# EAGLE board BMS_Master (EAGLE 6.6.0)
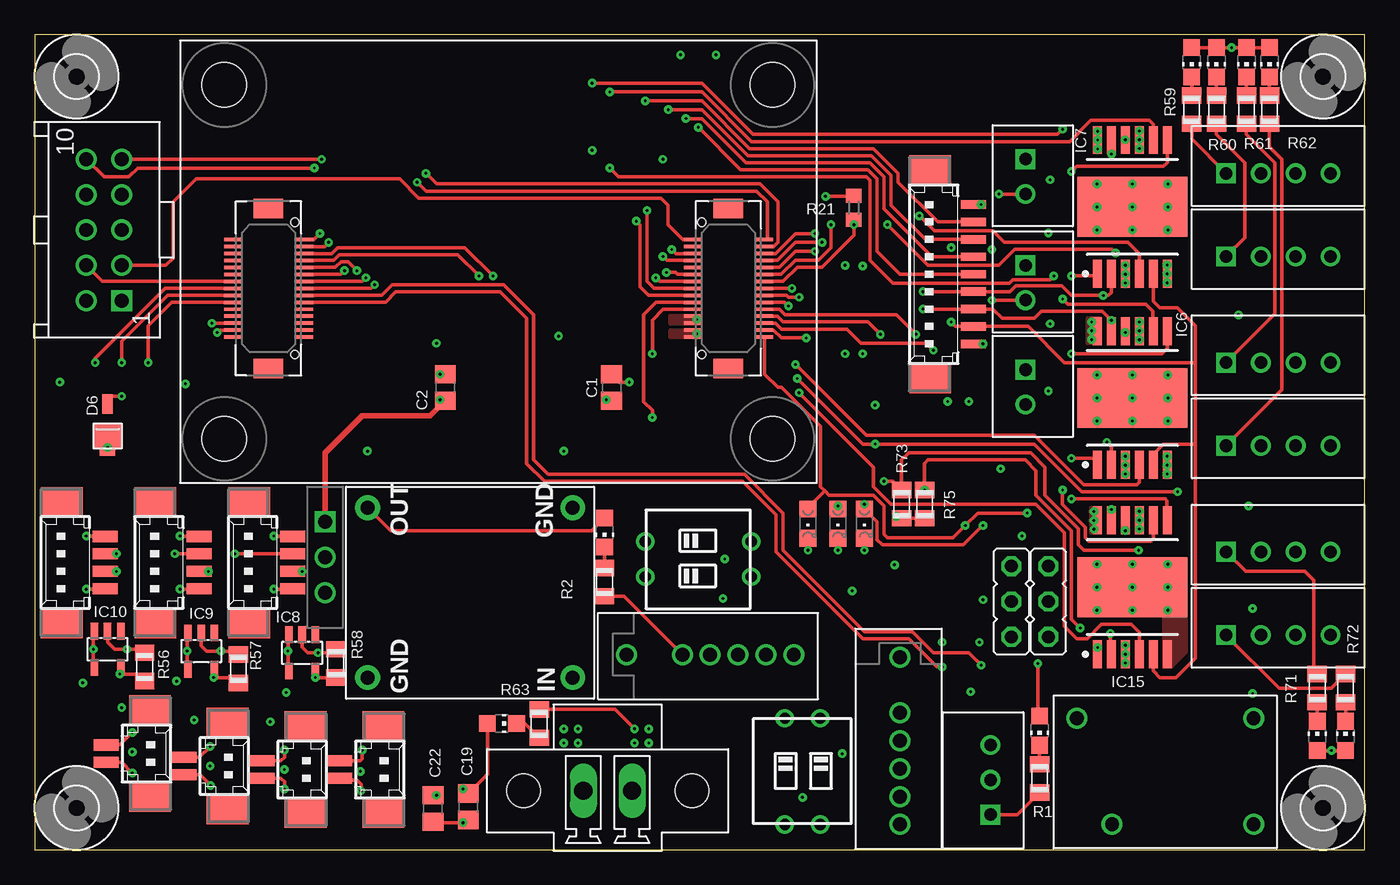
[diagram p6: board, top side]
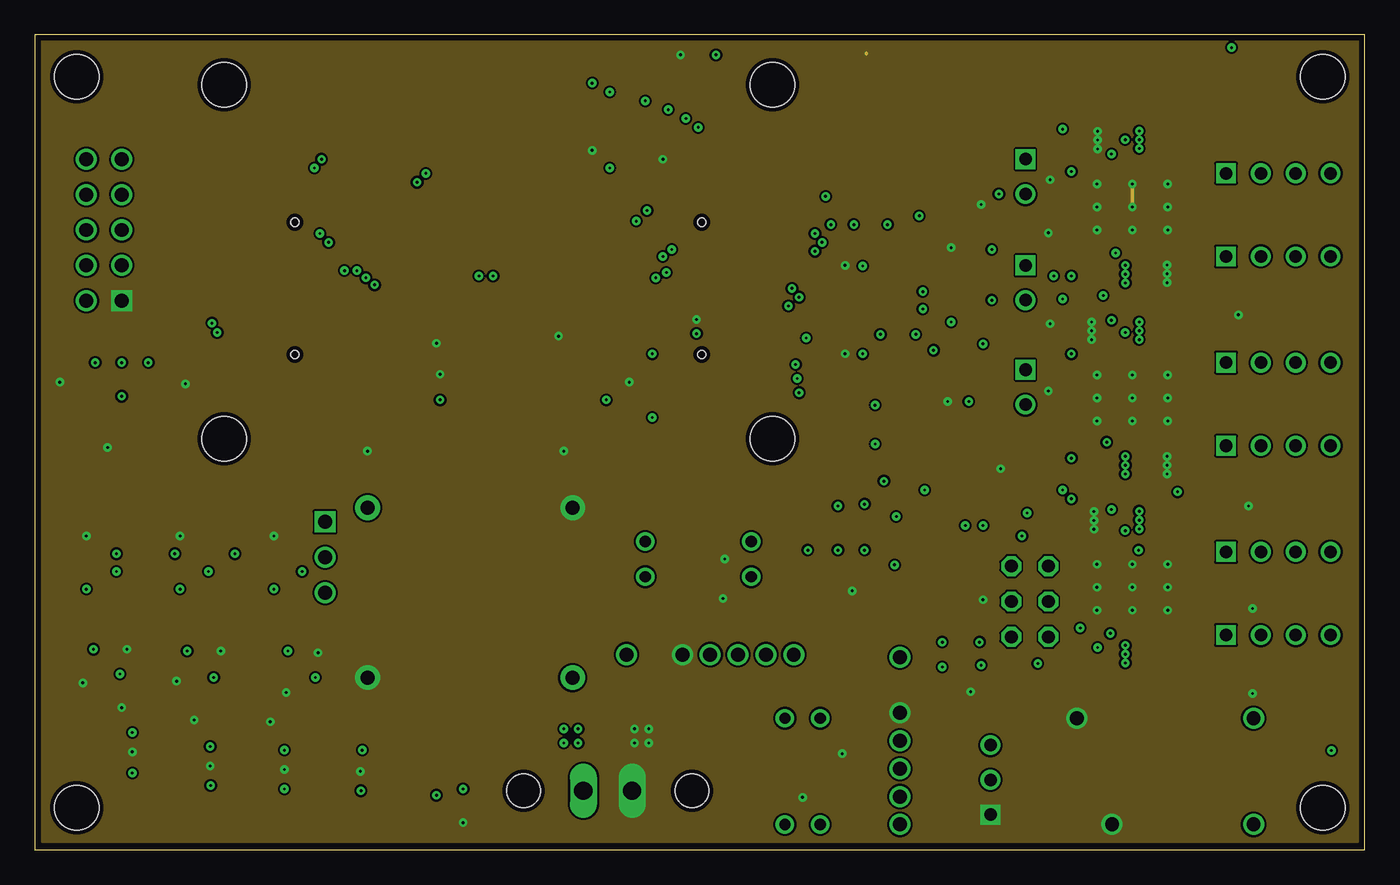
[diagram p7: board, inner layer Route2]
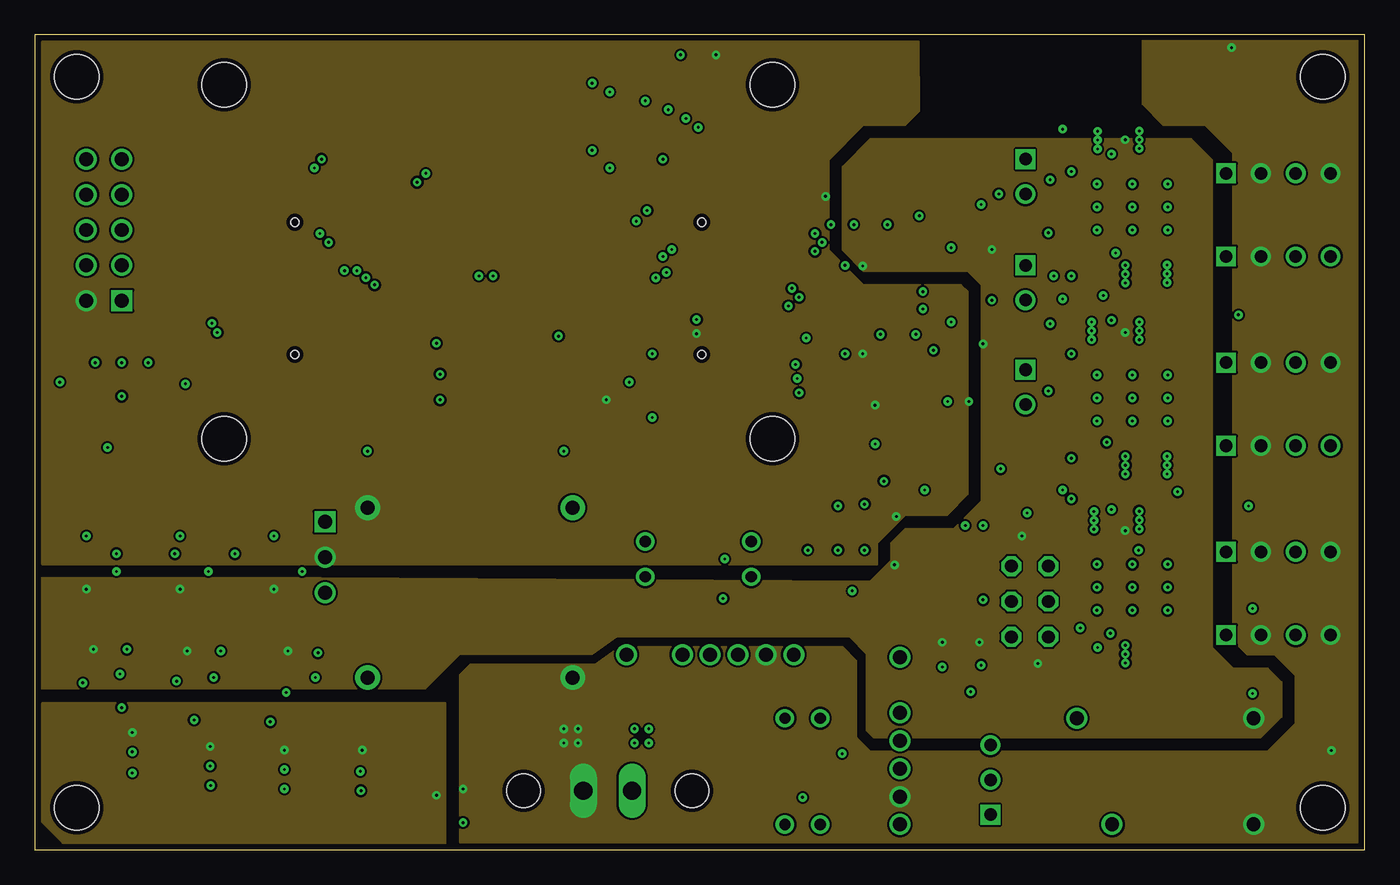
[diagram p8: board, inner layer Route15]
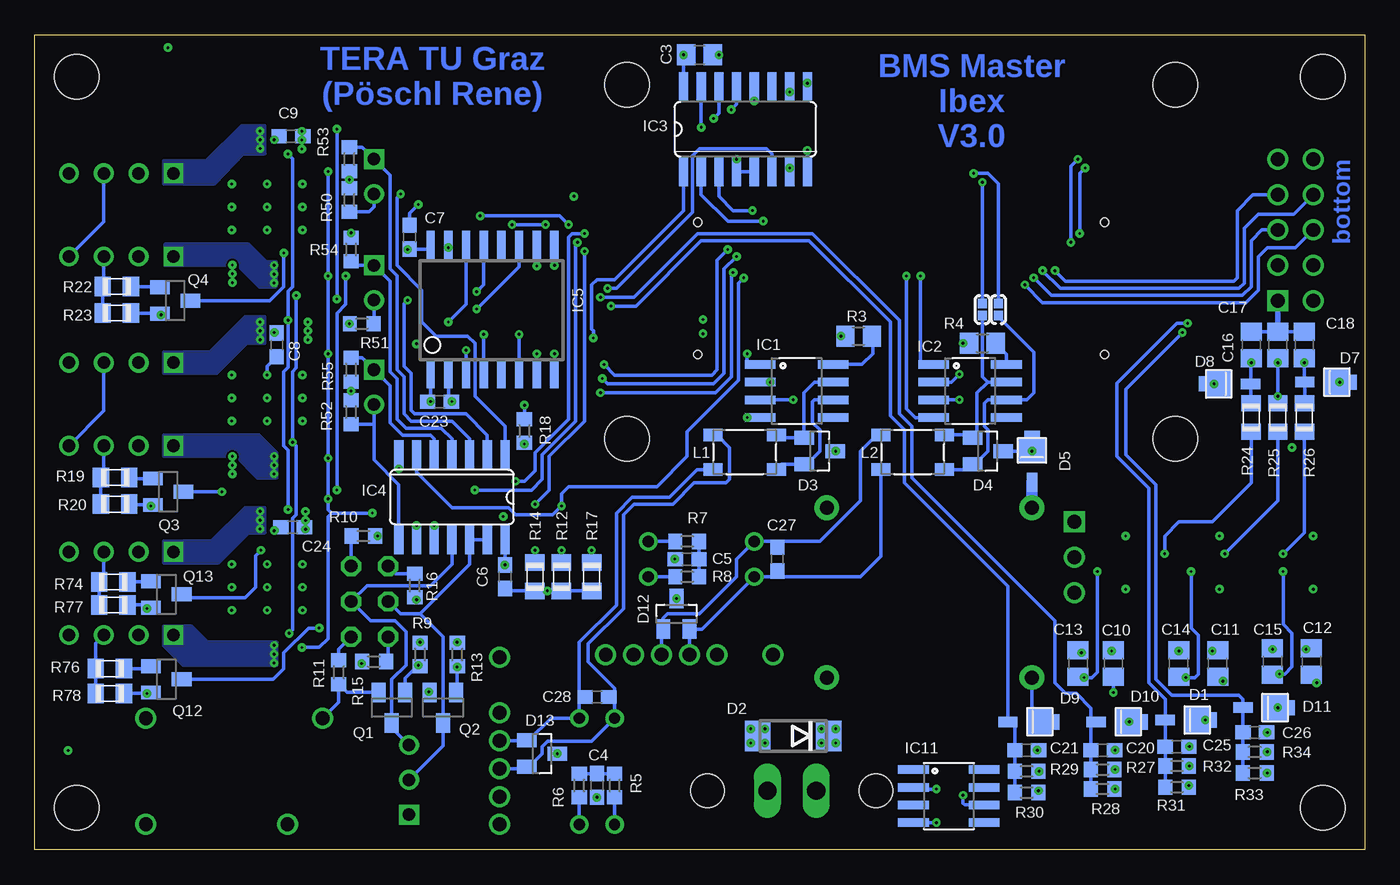
[diagram p9: board, bottom side, seen from below]

Size 95.5 x 58.5 mm. Coordinates in mm from the lower left corner, seen from the top.
Outline: 0,0 95.5,0 95.5,58.5 0,58.5 0,0
Copper layers (1+2*15+16): Top 0.035mm / dielectric 0.2mm / Route2 0.035mm / dielectric 0.5mm / Route15 0.035mm / dielectric 0.2mm / Bottom 0.035mm
Design rules "ats_35u_4layer *": minimum track width 6mil, minimum drill 0.2mm, track to track 6mil, track to pad 6mil, pad to pad 6mil, via to via 6mil, smd to smd 6mil, copper to edge 0.3mm, drill to drill 8mil, minimum pad ring 10mil, minimum via ring 0.2mm, stop-mask expansion 4mil, vias tented up to drill 0mil, thermal gap 10mil

## Footprints (pad centres in the part's own frame; a part is rotated, then mirrored left to right if it is on the bottom)
C0805 = smd 1.3 x 1.5: 1 -0.95,0; 2 0.95,0
C0603 = smd 1.1 x 1: 1 -0.85,0; 2 0.85,0
53398-09-S = smd 0.6 x 1.8: 1 5,-2.5; 2 3.75,-2.5; 3 2.5,-2.5; 4 1.25,-2.5; 5 0,-2.5; 6 -1.25,-2.5; 7 -2.5,-2.5; 8 -3.75,-2.5; 9 -5,-2.5 | smd 2.1 x 3: S1 7.5,0.625; S2 -7.5,0.625
53398-02 = smd 0.8 x 1.8: 1 0.625,-2.5; 2 -0.625,-2.5 | smd 2.1 x 3: S1 3.125,0.625; S2 -3.125,0.625
SM2T3V3A = smd 1.82 x 2.03: P$1 -1.21,0 | smd 1.38 x 0.75: P$2 1.1,0 | smd 0.5 x 1.1: P$11 -2.37,0.005
DO214AA = smd 1.8 x 2.2: A 2.55,0; C -2.55,0
SOT23 = smd 1 x 1.4: 1 -0.95,-1.1; 2 0.95,-1.1; 3 0,1.1
3,2 = hole 3.2: 0,0
SO08 = smd 0.61 x 2.21: 1 -1.905,-2.616; 2 -0.635,-2.616; 3 0.635,-2.616; 4 1.905,-2.616; 5 1.905,2.616; 6 0.635,2.616; 7 -0.635,2.616; 8 -1.905,2.616
SO16 = smd 0.66 x 2.032: 1 -4.445,-3.073; 2 -3.175,-3.073; 3 -1.905,-3.073; 4 -0.635,-3.073; 5 0.635,-3.073; 6 1.905,-3.073; 7 3.175,-3.073; 8 4.445,-3.073; 9 4.445,3.073; 10 3.175,3.073; 11 1.905,3.073; 12 0.635,3.073; 13 -0.635,3.073; 14 -1.905,3.073; 15 -3.175,3.073; 16 -4.445,3.073
SO14 = smd 0.66 x 2.032: 1 -3.81,-3.073; 2 -2.54,-3.073; 3 -1.27,-3.073; 4 0,-3.073; 5 1.27,-3.073; 6 2.54,-3.073; 7 3.81,-3.073; 8 3.81,3.073; 9 2.54,3.073; 10 1.27,3.073; 11 0,3.073; 12 -1.27,3.073; 13 -2.54,3.073; 14 -3.81,3.073
R-PDSO-G16 = smd 0.6 x 2: 1 -3.937,-4.649; 2 -2.667,-4.649; 3 -1.397,-4.649; 4 -0.127,-4.649; 5 1.143,-4.649; 6 2.413,-4.649; 7 3.683,-4.649; 8 4.953,-4.649; 9 4.953,4.651; 10 3.683,4.651; 11 2.413,4.651; 12 1.143,4.651; 13 -0.127,4.651; 14 -1.397,4.651; 15 -2.667,4.651; 16 -3.937,4.651
INF-PG-DSO-12-11_N_1PRIMARY = smd 2 x 0.65: 1 -4.8,2.5; 2 -4.8,1.5; 3 -4.8,0.5; 4 -4.8,-0.5; 5 -4.8,-1.5; 6 -4.8,-2.5; 7 4.8,-2.5; 8 4.8,-1.5; 9 4.8,-0.5; 10 4.8,0.5; 11 4.8,1.5; 12 4.8,2.5 | smd 4.3 x 7.9: 13 0,0
SOT23-5L = smd 0.55 x 1.2: 1 -0.95,-1.3; 2 0,-1.3; 3 0.95,-1.3; 4 0.95,1.3; 5 -0.95,1.3
SO08' = smd 0.61 x 2.21: 1 -1.905,-2.54; 2 -0.635,-2.54; 3 0.635,-2.54; 4 1.905,-2.54; 5 1.905,2.54; 6 0.635,2.54; 7 -0.635,2.54; 8 -1.905,2.54
J_OR_S = drill 1: P$1 2.54,0; P$3 5.08,0 | drill 1 square: P$2 0,0
JP2_OCT = drill 0.914 octagon: 1 -2.54,0; 2 0,0; 3 2.54,0
ACT45B = smd 1.35 x 0.9: P$1 -0.675,0.45; P$2 3.875,0.45; P$3 -0.675,2.95; P$4 3.875,2.95
CHIP-LED0805 = smd 1.2 x 1.2: A 0,-1.05; C 0,1.05
CHIPLED_0805 = smd 1.2 x 1.2: A 0,-1.05; C 0,1.05
STM32F4_PROZESSORBOARD = smd 1.2 x 0.25: 1 3.75,10.47; 2 8.95,10.47; 3 3.75,10.97; 4 8.95,10.97; 5 3.75,11.47; 6 8.95,11.47; 7 3.75,11.97; 8 8.95,11.97; 9 3.75,12.47; 10 8.95,12.47; 11 3.75,12.97; 12 8.95,12.97; 13 3.75,13.47; 14 8.95,13.47; 15 3.75,13.97; 16 8.95,13.97; 17 3.75,14.47; 18 8.95,14.47; 19 3.75,14.97; 20 8.95,14.97; 21 3.75,15.47; 22 8.95,15.47; 23 3.75,15.97; 24 8.95,15.97; 25 3.75,16.47; 26 8.95,16.47; 27 3.75,16.97; 28 8.95,16.97; 29 3.75,17.47; 30 8.95,17.47; 31 41.97,17.47; 32 41.97,16.97; 33 41.97,16.47; 34 41.97,15.97; 35 41.97,15.47; 36 41.97,14.97; 37 41.97,14.47; 38 41.97,13.97; 39 41.97,13.47; 40 41.97,12.97; 41 41.97,12.47; 42 41.97,11.97; 43 41.97,10.97; 44 41.97,10.47; 45 36.77,10.47; 46 36.77,10.97; 47 36.77,11.47; 48 36.77,11.97; 49 36.77,12.47; 50 36.77,12.97; 51 36.77,13.47; 52 36.77,13.97; 53 36.77,14.47; 54 36.77,14.97; 55 36.77,15.47; 56 36.77,15.97; 57 36.77,16.47; 58 36.77,16.97; 59 36.77,17.47; 60 41.97,11.47 | smd 2.1 x 1.4: M1 6.35,8.22; M2 6.35,19.72; M3 39.37,8.22; M4 39.37,19.72 | hole 3.2: 3.175,3.175; 3.175,28.575; 42.545,28.575; 42.545,3.175 | hole 0.6: 8.25,9.22; 8.25,18.72; 37.47,18.72; 37.47,9.22
R0805 = smd 1.168 x 1.397: 1 -1.016,0; 2 1.016,0
R0805' = smd 1.3 x 1.5: 1 -0.95,0; 2 0.95,0
R0603 = smd 1 x 1.1: 1 -0.85,0; 2 0.85,0
SJ_2S-NO = smd 0.686 x 0.635: 1 -0.425,0; 2 0.425,0
DIPSWITCH-02 = drill 0.813: 1 -1.27,-3.81; 2 1.27,-3.81; 3 1.27,3.81; 4 -1.27,3.81
MAX16956_STEPDOWN6 = drill 1: GND 14.351,1.651; GND2 11.811,9.271; VIN 1.651,9.271; VOUT 1.651,1.651
MAX5035_STEPDOWN3 = drill 1 pad 1.778: GND@1 1.524,16.256; GND@2 13.716,1.524; VIN 1.524,1.524; VOUT 13.716,16.256
MCV1,5/2-GF-3,5 = drill 1.3 long: 1 0,3.5; 2 0,0 | hole 2.4: 0,7.8; 0,-4.3
90130-1110 = drill 1 square: 1 -5.08,-1.27 | drill 1: 2 -5.08,1.27; 3 -2.54,-1.27; 4 -2.54,1.27; 5 0,-1.27; 6 0,1.27; 7 2.54,-1.27; 8 2.54,1.27; 9 5.08,-1.27; 10 5.08,1.27
CIOC_4-1-FV = drill 1: 1 0,0; 2 2,0; 3 4,0; 4 6,0; 5 -4,0; 6 8,0
B2B-XH = drill 0.9 pad 1.422 square: P$1 0,0 | drill 0.9 pad 1.422: P$2 2.5,0
B4B-XH = drill 0.9 pad 1.422 square: P$1 0,0 | drill 0.9 pad 1.422: P$2 2.5,0; P$3 5,0; P$4 7.5,0
53398-04 = smd 0.8 x 1.8: 1 1.875,-2.5; 2 0.625,-2.5; 3 -0.625,-2.5; 4 -1.875,-2.5 | smd 2.1 x 3: S1 4.375,0.625; S2 -4.375,0.625
B3B-XH = drill 0.9 pad 1.422 square: P$1 0,0 | drill 0.9 pad 1.422: P$2 2.5,0; P$3 5,0

## Placement (x,y rotation side)
C1  100n  [C0805]  41.42,33.19 90 top
C2  100n  [C0805]  29.48,33.19 90 top
C3  100n  [C0805]  47.77,57.06 0 bottom
C4  47n  [C0603]  55.14,4.61 270 bottom
C5  47n  [C0603]  48.66,20.87 180 bottom
C6  100n  [C0603]  61.74,19.6 270 bottom
C7  100n  [C0603]  68.6,43.98 270 bottom
C8  100n  [C0603]  78.12,36.24 270 bottom
C9  100n  [C0603]  77.11,51.22 0 bottom
C10  100n  [C0805]  18.05,13.38 270 bottom
C11  100n  [C0805]  10.56,13.38 270 bottom
C12  100n  [C0805]  3.83,13.5 270 bottom
C13  100n  [C0805]  20.59,13.38 90 bottom
C14  100n  [C0805]  13.35,13.38 90 bottom
C15  100n  [C0805]  6.62,13.5 90 bottom
C16  100n  [C0805]  8.15,36.24 90 bottom
C17  100n  [C0805]  6.24,36.24 90 bottom
C18  100n  [C0805]  4.34,36.24 90 bottom
C19  1uF  [C0805]  31.13,3.09 270 top
C20  ?  [C0603]  18.81,7.15 180 bottom
C21  ?  [C0603]  24.28,7.15 180 bottom
C22  2,2uF  [C0805]  28.59,2.96 270 top
C23  100n  [C0603]  66.44,32.17 180 bottom
C24  100n  [C0603]  76.98,23.16 0 bottom
C25  ?  [C0603]  13.48,7.41 180 bottom
C26  ?  [C0603]  7.89,8.42 180 bottom
C27  100p  [C0603]  42.18,20.87 90 bottom
C28  100p  [C0603]  55.14,10.96 0 bottom
CON1  53398-S-09  [53398-09-S]  64.92,41.32 90 top
CON2  53398-02  [53398-02]  24.4,5.76 270 top
CON3  53398-02  [53398-02]  18.81,5.76 270 top
CON4  53398-02  [53398-02]  13.23,6.01 270 top
CON5  53398-02  [53398-02]  7.64,6.9 270 top
D1  SM2T3V3A  [SM2T3V3A]  13.23,9.31 180 bottom
D2  18V  [DO214AA]  41.04,8.17 180 bottom
D3  NUP2105LT1G|SOT23  [SOT23]  39.13,28.62 270 bottom
D4  NUP2105LT1G|SOT23  [SOT23]  27.07,28.62 270 bottom
D5  SM2T3V3A  [SM2T3V3A]  23.89,27.47 270 bottom
D6  SM2T3V3A  [SM2T3V3A]  5.22,30.9 90 top
D7  SM2T3V3A  [SM2T3V3A]  3.19,33.57 180 bottom
D8  SM2T3V3A  [SM2T3V3A]  9.29,33.44 0 bottom
D9  SM2T3V3A  [SM2T3V3A]  24.53,9.19 180 bottom
D10  SM2T3V3A  [SM2T3V3A]  18.18,9.19 180 bottom
D11  SM2T3V3A  [SM2T3V3A]  7.64,10.2 180 bottom
D12  NUP2105LT1G|SOT23  [SOT23]  49.42,16.93 0 bottom
D13  NUP2105LT1G|SOT23  [SOT23]  59.07,6.9 270 bottom
H1  MOUNT-HOLE3.2  [3,2]  92.5,3 0 top
H2  MOUNT-HOLE3.2  [3,2]  3,3 0 top
H3  MOUNT-HOLE3.2  [3,2]  92.5,55.5 0 top
H4  MOUNT-HOLE3.2  [3,2]  3,55.5 0 top
IC1  SN65HVD230D  [SO08]  40.79,32.93 270 bottom
IC2  SN65HVD230D  [SO08]  28.34,32.93 270 bottom
IC3  74HC138D  [SO16]  44.47,51.73 0 bottom
IC4  4073D  [SO14]  65.55,25.31 180 bottom
IC5  ISO7241  [R-PDSO-G16]  63.14,38.78 0 bottom
IC6  TLE8102SGN  [INF-PG-DSO-12-11_N_1PRIMARY]  78.81,32.43 90 top
IC7  TLE8102SGN  [INF-PG-DSO-12-11_N_1PRIMARY]  78.81,46.15 90 top
IC8  1,8V  [SOT23-5L]  19.2,14.14 180 top
IC9  1,8V  [SOT23-5L]  11.96,14.27 180 top
IC10  1,8V  [SOT23-5L]  5.22,14.39 180 top
IC11  5V  [SO08']  29.86,3.85 270 bottom
IC15  TLE8102SGN  [INF-PG-DSO-12-11_N_1PRIMARY]  78.81,18.84 90 top
J3  JUMPER_SWITCHS  [J_OR_S]  20.85,23.54 270 top
JP3  [JP2_OCT]  70.12,17.82 90 top
JP4  [JP2_OCT]  72.79,17.82 270 top
L1  ACT45B-510-2P-TL003  [ACT45B]  46.12,26.84 0 bottom
L2  ACT45B-510-2P-TL003  [ACT45B]  34.05,26.84 0 bottom
LED1  green  [CHIP-LED0805]  72.15,8.55 180 top
LED2  green  [CHIP-LED0805]  40.91,22.77 180 top
LED3  green  [CHIPLED_0805]  57.68,23.41 180 top
LED4  green  [CHIPLED_0805]  59.58,23.41 180 top
LED5  green  [CHIPLED_0805]  55.52,23.41 180 top
LED6  green  [CHIP-LED0805]  83.08,56.53 180 top
LED7  green  [CHIP-LED0805]  84.85,56.53 180 top
LED8  green  [CHIP-LED0805]  87.01,56.53 180 top
LED9  green  [CHIP-LED0805]  88.66,56.53 180 top
LED10  green  [CHIP-LED0805]  33.55,9.06 270 top
LED12  green  [CHIP-LED0805]  92.09,8.17 0 top
LED13  green  [CHIP-LED0805]  94.12,8.17 0 top
PROZ1  STM32F4_PROZESSORBOARDRPZ  [STM32F4_PROZESSORBOARD]  10.43,26.33 0 top
Q1  BSS205N  [SOT23]  69.87,10.2 180 bottom
Q2  BSS205N  [SOT23]  66.19,10.2 180 bottom
Q3  BSS205N  [SOT23]  85.93,25.7 270 bottom
Q4  BSS205N  [SOT23]  85.42,39.41 270 bottom
Q12  BSS205N  [SOT23]  86.05,12.24 270 bottom
Q13  BSS205N  [SOT23]  86.05,18.33 270 bottom
R1  4k7  [R0805]  72.15,5.12 90 top
R2  2k2  [R0805]  40.91,19.22 90 top
R3  50k  [R0805']  36.34,36.87 0 bottom
R4  50k  [R0805']  27.45,36.36 0 bottom
R5  60R  [R0603]  53.87,4.61 270 bottom
R6  60R  [R0603]  56.41,4.61 270 bottom
R7  60R  [R0603]  48.66,22.14 180 bottom
R8  60R  [R0603]  48.66,19.6 180 bottom
R9  10k  [R0603]  67.84,14.01 270 bottom
R10  1k  [R0603]  71.9,22.52 0 bottom
R11  10k  [R0603]  73.68,12.74 90 bottom
R12  2k2  [R0805]  57.68,19.6 90 bottom
R13  10k  [R0603]  65.17,14.01 270 bottom
R14  2k2  [R0805]  59.58,19.6 90 bottom
R15  1k  [R0603]  71.14,13.5 180 bottom
R16  10k  [R0603]  68.22,18.96 90 bottom
R17  2k2  [R0805]  55.52,19.6 90 bottom
R18  1K  [R0603]  60.34,30.07 90 bottom
R19  1K  [R0805]  89.74,26.71 180 bottom
R20  10K  [R0805]  89.74,24.81 180 bottom
R21  1K  [R0603]  58.81,46.09 90 top
R22  1K  [R0805]  89.61,40.43 180 bottom
R23  10K  [R0805]  89.61,38.53 180 bottom
R24  1K  [R0805]  8.15,31.03 90 bottom
R25  1K  [R0805]  6.24,31.03 90 bottom
R26  1K  [R0805]  4.34,31.03 90 bottom
R27  ?  [R0603]  18.81,5.76 0 bottom
R28  ?  [R0603]  18.81,4.36 180 bottom
R29  ?  [R0603]  24.28,5.63 0 bottom
R30  ?  [R0603]  24.28,4.11 180 bottom
R31  ?  [R0603]  13.48,4.49 180 bottom
R32  ?  [R0603]  13.48,6.01 0 bottom
R33  ?  [R0603]  7.89,5.5 180 bottom
R34  ?  [R0603]  7.89,7.03 0 bottom
R50  10K  [R0603]  72.92,46.65 270 bottom
R51  10K  [R0603]  72.03,37.76 0 bottom
R52  10K  [R0603]  72.79,31.41 270 bottom
R53  10K  [R0603]  72.92,49.57 90 bottom
R54  10K  [R0603]  72.79,43.09 270 bottom
R55  10K  [R0603]  72.79,34.46 90 bottom
R56  330R  [R0805]  7.89,13.12 90 top
R57  330R  [R0805]  14.62,13 90 top
R58  330R  [R0805]  21.61,13.38 90 top
R59  12k  [R0805]  83.08,53.13 90 top
R60  12k  [R0805]  84.85,53.13 90 top
R61  12k  [R0805]  87.01,53.13 90 top
R62  12k  [R0805]  88.66,53.13 90 top
R63  12k  [R0805]  36.21,9.06 270 top
R71  12k  [R0805]  92.09,11.6 270 top
R72  12k  [R0805]  94.12,11.6 270 top
R73  1K  [R0805]  62.25,24.81 270 top
R74  1K  [R0805]  89.86,19.22 180 bottom
R75  1K  [R0805]  63.9,24.81 270 top
R76  1K  [R0805]  90.12,13 180 bottom
R77  10K  [R0805]  89.86,17.57 180 bottom
R78  10K  [R0805]  90.12,11.22 180 bottom
SJ1  SOLDERJUMPERNO  [SJ_2S-NO]  27.45,38.78 90 bottom
SJ2  SOLDERJUMPERNO  [SJ_2S-NO]  26.31,38.78 90 bottom
SW1  DIP_SWITCH_DIP2  [DIPSWITCH-02]  47.64,20.87 270 top
SW2  DIP_SWITCH_DIP2  [DIPSWITCH-02]  55.14,5.63 180 top
TB1  MAX16956_STEPDOWN6  [MAX16956_STEPDOWN6]  89.17,11.09 180 top
TERA-DC/DC1  [MAX5035_STEPDOWN3]  40.15,10.84 90 top
X1  MCV1,5/2-GF-3,5  [MCV1,5/2-GF-3,5]  39.39,4.23 270 top
X2  TERA-PROG-DEBUG-10GERADE  [90130-1110]  4.97,44.49 90 top
X3  CIOC_4-1-FV-A_CAN-BELEGUNG  [CIOC_4-1-FV]  46.5,14.01 0 top
X4  CIOC_4-1-FV-A_CAN-BELEGUNG  [CIOC_4-1-FV]  62.12,9.82 270 top
X6  B2B-XH  [B2B-XH]  71.14,49.57 270 top
X7  B2B-XH  [B2B-XH]  71.14,41.95 270 top
X8  B2B-XH  [B2B-XH]  71.14,34.46 270 top
X9  B4B-XH  [B4B-XH]  85.55,29 0 top
X10  B4B-XH  [B4B-XH]  85.55,34.97 0 top
X11  B4B-XH  [B4B-XH]  85.55,42.59 0 top
X12  B4B-XH  [B4B-XH]  85.55,48.56 0 top
X13  53398-04  [53398-04]  16.02,20.62 90 top
X14  53398-04  [53398-04]  9.29,20.62 90 top
X15  53398-04  [53398-04]  2.56,20.62 90 top
X20  B3B-XH  [B3B-XH]  68.63,2.52 90 top
X21  B4B-XH  [B4B-XH]  85.55,21.38 0 top
X22  B4B-XH  [B4B-XH]  85.55,15.41 0 top

## Tracks (layer width: path | path; a pad name or v marks a point on that pad's centre or on a via)
+3V3  (via drill 0.2)
  Top 0.254: LED2.A 39.99,22.9 25.55,22.9 TERA-DC/DC1.VOUT | R21.2 58.81,46.9 v56.79,46.9 | C1.1 41.48,32.3 v41.04,32.3 | R75.2 R73.2 61.99,23.79 v61.87,23.92
  Bottom 0.254: IC3.16 48.91,56.87 | v48.91,57.06 48.91,56.87 | 48.91,56.87 C3.1 | v59.45,35.6 IC5.7 | 60.34,30.91 R18.2 v60.34,31.92 | IC5.1 v67.07,32.17 C23.2 | v41.04,32.3 IC1.3
  Bottom 0.813: D5.P$2 TERA-DC/DC1.VOUT
  other vias: 47.52,37.05
  pour Route15 (isolate 0.152, no thermals): 0.5,20.5 20.5,20.5 60.5,20.49 60.5,22.03 62.49,24.03 65.52,24.04 67.02,25.54 67.02,40.04 66.52,40.54 59.52,40.54 57.02,43.04 57.02,49.54 59.52,52.04 62.52,52.04 63.52,53.04 63.5,58 0.5,58
  pour Top (no thermals): 47.82,36.79 45.61,36.79 45.61,37.3 47.82,37.3
+5V  (via drill 0.2)
  Top 0.254: IC6.10 78.31,37.22 v78.31,37.13 | IC10.4 4.21,13.16 v4.21,14.39 4.21,15.63 IC10.3 | IC9.4 10.94,13.03 v10.94,14.27 10.94,15.5 IC9.3 | IC8.3 18.18,15.37 v18.18,14.27 18.18,12.9 IC8.4 | X13.4 17.83,18.74 17.8,18.71 v17.16,18.71 | X14.4 11.22,18.74 11.19,18.71 v10.43,18.71 | X15.4 4.37,18.74 4.34,18.71 v3.7,18.71 | v78.31,50.97 78.31,50.94 IC7.10 | v78.31,22.91 78.31,23.63 IC15.10 | CON1.9 v68.09,36.32 | LED1.A 72.03,9.73 v72.03,13.38
  Bottom 0.254: 4.02,14.45 C12.1 3.89,14.39 v4.21,14.39 | C11.1 10.88,14.33 v10.94,14.27 | v18.18,14.27 18.11,14.27 C10.1 | IC5.16 67.07,43.09 v68.72,43.09 68.69,43.13 C7.2 | IC5.10 v59.45,41.91 | R10.2 v70.88,22.52 | v78.31,37.13 78.12,37.13 C8.1 | v78.31,50.97 IC7.10 78.31,50.95 v78.31,50.97 78.06,51.22 C9.1 | C24.1 78.31,23.16 v78.31,22.91 | R9.1 v67.84,14.9 | R15.2 71.99,13.42 v72.03,13.38 | R13.1 v65.17,14.9 | IC4.14 C6.1
  other vias: 61.74,20.45
  pour Route15 (isolate 0.152, no thermals): 83.02,51.04 84.52,49.54 84.52,14.54 86.02,13.04 88.52,13.04 89.52,12.04 89.52,9.54 88.02,8.04 60.27,8.04 59.77,8.54 59.77,14.04 58.52,15.29 41.77,15.29 40.02,14.04 30.52,14.04 28.02,11.54 0.52,11.54 0.52,19.54 20.52,19.54 60.02,19.29 61.52,20.79 61.52,22.04 62.52,23.04 66.02,23.04 68.02,25.04 68.02,40.54 67.02,41.54 59.52,41.54 58.02,43.04 58.02,49.04 60.02,51.04
CAN1_H
  Bottom 0.254: L2.P$3 35.04,29.79 36.21,28.62 36.21,25.06 39.13,22.14 42.18,22.14 | 42.18,22.14 SW1.1 45.1,20.87 45.1,19.6 47.77,16.93 50.06,16.93 50.37,16.62 D12.1 50.5,15.7 X3.3 | C27.2 42.18,22.14
CAN1_H0
  Bottom 0.254: D4.1 28.39,29.79 | 28.39,29.79 L2.P$4 | SJ1.1 27.45,33.95 27.07,33.57 | 27.07,33.57 IC2.7 | 28.39,29.79 27.83,29.79 27.83,32.81 27.07,33.57
CAN1_L
  Bottom 0.254: L2.P$1 34.73,21.08 36.21,19.6 42.18,19.6 | 42.18,19.6 SW1.2 47.6,15.83 D12.2 48.5,15.8 X3.2 | C27.1 42.18,19.6
CAN1_L0
  Bottom 0.254: L2.P$2 28.55,27.29 D4.2 28.02,27.67 27.07,28.62 27.07,30.14 27.32,30.39 27.32,32.04 27.07,32.3 IC2.6 24.28,32.3 23.77,32.81 23.77,35.73 26.31,38.27 SJ2.1
CAN1_RXD  (via drill 0.2)
  Top 0.254: v32.91,41.19 30.88,43.22 21.73,43.22 21.31,42.8 PROZ1.26
  Bottom 0.254: IC2.4 32.28,31.03 32.91,31.66 v32.91,41.19
CAN1_TXD  (via drill 0.2)
  Top 0.254: v31.89,41.19 30.37,42.71 21.86,42.71 21.45,42.3 PROZ1.24
  Bottom 0.254: v31.89,41.19 31.89,34.79 31.01,34.79 IC2.1
CAN2_H
  Bottom 0.254: L1.P$3 46.53,29.79 45.61,28.87 45.61,26.58 45.87,26.33 48.15,26.33 49.67,24.81 52.47,24.81 53.23,24.04 53.23,17.31 55.77,14.77 55.77,13.5 53.87,11.6 53.87,10.96 | 53.87,10.96 SW2.2 55.52,7.79 58.69,7.79 59.07,7.41 59.07,6.9 60.02,5.95 D13.2 60.3,5.82 X4.3 | C28.2 53.87,10.96
CAN2_H0
  Bottom 0.254: IC1.7 39.52,33.57 40.28,32.81 40.28,29.61 D3.1 42.02,29.57 L1.P$4
CAN2_L
  Bottom 0.254: L1.P$1 47.95,27.29 49.93,25.31 52.6,25.31 53.74,24.17 53.74,17.57 56.41,14.9 56.41,10.96 | 56.41,10.96 SW2.1 58.44,9.44 60.03,7.85 D13.1 60.2,7.82 X4.2 | C28.1 56.41,10.96
CAN2_L0
  Bottom 0.254: IC1.6 39.52,32.3 39.64,32.17 39.64,30.65 39.13,30.14 39.13,28.62 40.08,27.67 D3.2 41.87,27.67 L1.P$2
CAN2_RXD  (via drill 0.2)
  Top 0.254: PROZ1.50 44.61,39.3 43.71,38.39 43.71,32.17 44.34,31.54 v44.34,31.03
  Bottom 0.254: v44.34,31.03 IC1.4
CAN2_TXD  (via drill 0.2)
  Top 0.254: PROZ1.49 45.13,38.8 44.34,38.01 v44.34,35.6
  Bottom 0.254: v44.34,35.6 44.34,34.84 IC1.1
CANP_H  (via drill 0.2)
  Top 0.254: PROZ1.31 52.6,43.8 52.6,46.52 51.83,47.28 28.09,47.28 v27.45,47.92
  Bottom 0.254: SJ1.2 v27.45,47.92
CANP_L  (via drill 0.2)
  Top 0.254: PROZ1.32 53.06,43.3 53.36,43.6 53.36,46.52 52.09,47.79 28.85,47.79 v28.09,48.55
  Bottom 0.254: v28.09,48.55 27.07,48.55 26.31,47.79 SJ2.2
CS_B0  (via drill 0.2)
  Top 0.254: v55.39,36.74 53.61,36.74 53.06,37.3 PROZ1.43
  Bottom 0.254: 49.04,49.57 48.91,49.44 IC3.1 48.91,45.89 53.87,40.93 55.14,40.93 55.52,40.55 55.52,37.38 55.39,37.25 v55.39,36.74
CS_B1  (via drill 0.2)
  Top 0.254: PROZ1.51 44.08,39.8 43.45,40.43 43.45,44.87 v43.2,45.13
  Bottom 0.254: IC3.2 47.64,47.03 45.74,45.13 v43.2,45.13
CS_B2  (via drill 0.2)
  Top 0.254: PROZ1.52 44.47,40.3 43.96,40.81 v43.96,45.89
  Bottom 0.254: IC3.3 46.37,46.9 45.36,45.89 v43.96,45.89
GND  (via drill 0.2)
  Top 0.254: IC7.13 77.04,46.15 76.31,46.87 | X15.1 4.75,22.49 4.72,22.52 v3.7,22.52 | X14.1 11.61,22.49 11.58,22.52 v10.43,22.52 | X13.1 18.08,22.49 18.05,22.52 v17.16,22.52 | IC8.2 19.2,14.52 19.58,14.14 v20.34,14.14 21.35,14.14 R58.2 | IC9.2 11.96,14.65 12.34,14.27 v13.35,14.27 14.37,14.27 R57.2 | IC10.2 5.22,14.9 5.73,14.39 v6.62,14.39 7.64,14.39 R56.2 | 76.27,50.91 v76.31,50.95 | D6.P$11 v5.22,28.87 D6.P$1 4.99,29.93 | IC6.12 76.31,37.17 76.15,37 | IC15.6 81.31,13.25 81.35,13.25 | v81.31,27.6 IC6.6 | CON1.1 v67.96,46.32 | C1.2 41.99,33.57 v42.69,33.57 | C19.2 30.94,1.95 v30.75,1.95 28.66,1.95 C22.2 | R1.1 70.56,2.52 X20.P$1 | R63.1 41.67,10.07 v43.07,8.68 | R2.1 42.31,18.2 X3.1 | C2.2 v29.1,34.14
  Route2 0.254: v78.81,47.8 IC7.13 | 59.71,57.19 59.71,57.15
  Bottom 0.254: v43.07,7.66 43.59,7.66 D2.A | IC1.2 v42.69,33.57 | R3.1 v37.61,36.87 | R4.1 v28.85,36.36 | IC3.5 IC3.4 v45.1,49.57 | v6.62,14.39 6.56,14.39 C15.2 | v13.35,14.27 13.29,14.27 C14.2 | v20.34,14.14 20.4,14.14 C13.2 | C16.2 C17.2 C18.2 4.27,37.12 3.7,37.12 | 39.92,48.66 IC3.8 v40.02,50.21 | C3.2 v46.37,57.06 | v10.18,12.11 10.24,12.11 C11.2 | v3.45,11.98 3.45,12.17 C12.2 | v69.36,27.35 IC4.7 | R78.1 v87.45,11.22 87.22,11.22 Q12.2 | Q13.2 87.38,17.38 v87.45,17.32 87.7,17.57 R77.1 | R23.1 86.58,38.53 Q4.2 86.5,38.46 v86.43,38.4 | C8.2 78.81,34.7 v78.81,34.08 | C24.2 76.13,23.08 v76.06,23.01 | R20.1 88.66,24.75 Q3.2 87.09,24.68 v87.16,24.68 | R17.1 R12.1 v58.69,18.58 R14.1 61.74,18.58 C6.2 | IC5.15 v65.8,43.22 | v58.18,35.6 IC5.8 | IC5.9 v58.18,41.95 | C7.1 68.6,45.68 v67.96,46.32 | IC5.2 65.8,32.51 65.59,32.3 C23.1 v65.55,32.17 | R50.1 v72.92,48.09 R53.1 | R54.1 v72.79,44.28 | R51.1 v72.92,37.76 | R52.1 v72.79,32.93 R55.1 | D7.P$1 v1.8,33.57 v1.79,33.56 D7.P$11 | D8.P$1 v10.81,33.44 v10.82,33.45 D8.P$11 | 76.31,50.97 v76.31,50.95 76.26,51 C9.2 | D3.3 v37.99,28.62 | IC11.4 v30.75,1.95 | D9.P$11 D9.P$1 23.89,9.76 TERA-DC/DC1.GND@1 | D11.P$11 v6.24,10.2 D11.P$1 | R34.2 v7,7.03 | R32.2 v12.59,6.01 | D1.P$11 v11.45,9.31 D1.P$1 | D10.P$11 v16.91,9.19 D10.P$1 | R27.2 v17.93,5.76 | R29.2 v23.39,5.63 | R16.1 68.22,18.07 v68.09,17.95 | C5.2 v49.54,20.87 | Q2.2 67.16,11.3 v67.2,11.34 | Q1.2 73.09,11.3 R11.1 73.68,10.58 TB1.GND | v23.89,28.62 D5.P$11 D5.P$1 23.96,28.62 D4.3 | C10.2 v18.05,11.29 | IC2.2 29.67,33.57 v29.1,34.14
  Bottom 0.406: C17.2 X2.1
  other vias: 47.52,38.06 44.09,8.68 44.09,7.66 76.27,44.49 78.81,44.49 81.35,44.49 81.35,46.15 81.35,47.8 78.81,46.15 76.27,47.8 76.27,46.15 78.81,30.78 78.81,32.43 81.35,30.78 81.35,32.43 81.35,34.08 76.27,30.78 76.27,32.43 76.27,34.08 76.27,17.19 81.35,17.19 81.35,18.84 81.35,20.49 78.81,20.49 76.27,18.84 78.81,17.19 78.81,18.84 76.27,20.49 81.31,26.97 81.31,28.24 75.89,36.62 75.89,37.26 75.89,37.89 81.31,41.35 81.31,41.98 81.31,40.71 76.06,23.64 76.06,24.28 76.31,51.58 76.31,50.31 55.14,3.76 57.97,6.9 49.42,18.03
  pour Top (no thermals): 47.82,37.76 45.61,37.76 45.61,38.32 47.82,38.32
  pour Route2 (isolate 0.152, no thermals): 0.52,0.54 0.52,58.04 95.02,58.04 95.02,0.54
  pour Top (no thermals): 82.62,17.57 82.62,14.14 81.61,13.13 81.1,13.13 81.1,17.57
  pour Top (no thermals): 76.47,38.14 75.58,38.14 75.58,36.36 76.47,36.36
  pour Top (no thermals): 76.47,24.55 75.84,24.55 75.84,22.77 76.47,22.77
HS_CO1  (via drill 0.2)
  Top 0.254: PROZ1.36 53.6,41.3 54.63,42.33 56.28,42.33 57.17,43.22 v57.17,44.87 | IC7.4 79.31,42.79 78.5,43.6 69.61,43.6 68.79,44.43 64.6,44.43 v63.52,45.51
  Bottom 0.254: v63.52,45.51 57.8,45.51 v57.17,44.87
HS_RM  (via drill 0.2)
  Top 0.254: PROZ1.37 53.73,40.8 54.76,41.82 56.53,41.82 58.82,44.11 v58.82,44.87 v58.81,44.88 R21.1 | v77.61,42.84 77.36,43.09 70.38,43.09 69.23,41.95 64.15,41.95 v61.23,44.87
  Bottom 0.254: v77.61,42.84 77.61,40.43 78.63,39.41 Q4.3 | v61.23,44.87 v58.82,44.87
HS_RM_EX
  Bottom 0.254: R23.2 R22.2 90.55,40.51 X11.P$3
IL1  (via drill 0.2)
  Top 0.254: PROZ1.14 24.92,39.8 25.67,40.55 33.67,40.55 35.83,38.39 35.83,27.98 36.85,26.96 50.95,26.96 53.74,24.17 53.74,21.5 59.58,15.66 63.01,15.66 64.53,14.14 67.07,14.14 v67.96,13.25
  Bottom 0.254: R9.2 68.05,13.16 v67.96,13.25 68.92,12.29 Q1.1
IL2  (via drill 0.2)
  Top 0.254: PROZ1.12 25.18,39.3 25.93,40.05 33.42,40.05 35.32,38.14 35.32,27.73 36.59,26.46 50.82,26.46 53.23,24.04 53.23,21.38 59.45,15.15 62.76,15.15 64.79,13.12 v65.17,13.12
  Bottom 0.254: R13.2 v65.17,13.12 65.17,11.37 Q2.1
ILK1
  Bottom 0.254: X20.P$3 69.87,8.76 Q1.3 69.87,12.23 68.85,13.25 68.85,15.66 69.61,16.42 71.39,16.42 JP4.2 71.65,18.96 67.07,18.96 65.55,20.49 IC4.11
ILK2
  Bottom 0.254: IC4.13 IC4.12 64.28,20.49 67.84,16.93 | X20.P$2 66.19,7.46 Q2.3 66.19,15.28 67.84,16.93 | 67.84,16.93 69.23,16.93 JP3.2
INTERLOCK_OK  (via drill 0.2)
  Top 0.254: 76.21,41.45 IC7.1 76.31,41.19 v74.44,41.19 | IC7.7 81.31,49.33 81.04,49.06 74.82,49.06 v74.44,48.68 | IC6.7 81.31,36 80.92,35.6 v74.44,35.6 | PROZ1.44 52.4,34.14 53.36,33.19 53.61,33.19 56.41,30.39 56.41,26.08 56.72,25.76 | LED5.A 55.52,24.55 56.72,25.76 | 56.72,25.76 57.04,25.44 60.22,25.44 60.98,24.68 60.98,22.65 61.23,22.39 65.93,22.39 v66.82,23.28 67.71,24.17 v71.27,24.17 | v76.31,14.52 IC15.1 | IC15.7 81.3,23.66 81.3,25.06 81.17,25.19 v74.44,25.19 | v74.44,28.11 76.31,28.11 IC6.1
  Bottom 0.254: v74.44,48.68 v74.44,41.19 v74.44,35.6 v74.44,28.11 v74.44,25.19 74.44,24.43 74.19,24.17 | v66.82,23.28 IC4.10 | 74.19,24.17 v71.27,24.17 | 74.19,24.17 74.44,23.92 74.44,15.15 75.08,14.52 v76.31,14.52
JTCK  (via drill 0.2)
  Top 0.254: PROZ1.18 23.5,40.8 v23.77,41.06
  Bottom 0.254: v23.77,41.06 22.5,39.79 8.78,39.79 8.15,40.43 8.15,43.73 7.38,44.49 X2.5
JTDI  (via drill 0.2)
  Top 0.254: PROZ1.16 24.15,40.3 v24.4,40.55
  Bottom 0.254: X2.6 4.97,43.22 7,43.22 7.64,42.59 7.64,40.17 8.53,39.28 23.13,39.28 v24.4,40.55
JTDO  (via drill 0.2)
  Top 0.254: PROZ1.20 21.97,41.3 v22.24,41.57
  Bottom 0.254: X2.7 8.02,47.03 9.16,45.89 9.16,41.06 9.42,40.81 21.48,40.81 v22.24,41.57
JTMS
  Top 0.254: X2.3 9.42,41.95 9.92,42.46 9.92,46.52 11.58,48.17 26.18,48.17 27.58,46.78 44.98,46.78 45.48,46.27 45.48,44.87 46.56,43.8 PROZ1.59
JTNRST  (via drill 0.2)
  Top 0.254: PROZ1.22 21.58,41.8 21.99,42.2 22.5,42.2 v23.13,41.57
  Bottom 0.254: X2.8 5.1,45.63 7.64,45.63 8.65,44.62 8.65,40.68 9.04,40.3 21.86,40.3 v23.13,41.57
LEM_1  (via drill 0.2)
  Top 0.254: PROZ1.15 9.35,40.3 C18.1 v4.34,34.97
  Bottom 0.254: C18.1 v4.34,34.97 4.34,33.61 D7.P$2 4.29,32.04 R26.2
LEM_2  (via drill 0.2)
  Top 0.254: v6.24,34.97 6.24,36.49 9.55,39.8 PROZ1.13 | D6.P$2 5.35,32.13 5.35,32.55 v6.24,32.55
  Bottom 0.254: C17.1 v6.24,34.97 v6.24,32.55 R25.2
LEM_3  (via drill 0.2)
  Top 0.254: PROZ1.11 9.81,39.3 8.15,37.63 v8.15,34.97
  Bottom 0.254: C16.1 v8.15,34.97 8.19,34.92 D8.P$2 8.19,32.09 R24.2 8.15,32.43
MISO  (via drill 0.2)
  Top 0.254: IC7.11 v77.31,49.95 | IC6.11 v77.31,38.01 76.68,38.65 72.28,38.65 71.77,38.14 69.49,38.14 68.81,38.82 CON1.7 v63.77,38.82 | IC15.11 v77.31,24.43
  Bottom 0.254: v77.31,24.43 77.31,28.7 77.61,29 77.61,34.33 77.31,34.63 v77.31,38.01 77.31,40.09 76.98,40.43 76.98,49.62 v77.31,49.95 | IC5.11 60.72,41.86 v63.77,38.82
MISO_M  (via drill 0.2)
  Top 0.254: v60.72,37 59.84,37.89 53.74,37.89 53.33,38.3 PROZ1.42
  Bottom 0.254: v60.72,37 IC5.6
MOSI  (via drill 0.2)
  Top 0.254: IC6.2 77.31,28.92 v76.98,29.25 | IC7.2 77.31,40 77.11,39.79 v76.73,39.79 74.44,39.79 73.74,40.49 70.44,40.49 70.02,40.07 CON1.6 v63.77,40.07 | IC15.2 77.23,14.04 v77.23,15.54
  Bottom 0.254: v76.73,39.79 76.73,34.58 76.98,34.33 v76.98,29.25 76.73,29 76.73,24.04 76.98,23.79 76.98,15.79 v77.23,15.54 | IC5.13 63.26,40.57 v63.77,40.07
MOSI_M  (via drill 0.2)
  Top 0.254: v63.26,37 61.87,38.39 53.87,38.39 53.46,38.8 PROZ1.41
  Bottom 0.254: v63.26,37 IC5.4
N$1
  Top 0.254: LED1.C R1.2
N$2
  Top 0.254: LED2.C R2.2
N$3
  Bottom 0.254: R7.1 C5.1 R8.1
N$4  (via drill 0.2)
  Top 0.254: X13.3 19.19,19.99 v19.2,19.98 | R58.1 v20.14,12.36 IC8.5
  Bottom 0.254: 20.08,11.92 C13.1 20.53,12.36 v20.14,12.36 19.58,12.36 19.2,12.74 v19.2,19.98
N$5
  Bottom 0.254: X10.P$3 90.55,31.5 X9.P$4
N$6  (via drill 0.2)
  Top 0.254: IC7.3 v78.31,40.68 | R60.1 84.85,51.35 86.89,49.32 86.89,43.93 X11.P$1
  other vias: 78.31,41.95 78.31,41.32
  pour Bottom (no thermals): 78.17,40.43 79.39,40.43 80.92,41.95 86.12,41.95 86.12,43.47 80.16,43.47 78.89,42.2 78.17,42.2
N$7  (via drill 0.2)
  Top 0.254: v5.86,21.25 X15.2
  Bottom 0.254: R26.1 4.34,22.77 v5.86,21.25
N$9  (via drill 0.2)
  Top 0.254: IC9.5 12.91,12.8 12.85,12.74 v12.85,12.36 14.24,12.36 R57.1 | X14.3 12.45,19.99 v12.46,19.98
  Bottom 0.254: 12.85,11.92 C14.1 | 13.29,12.49 C14.1 | v12.46,19.98 12.46,15.92 11.96,15.41 11.96,12.61 12.21,12.36 v12.85,12.36 13.29,12.36 C14.1
N$10  (via drill 0.2)
  Top 0.254: IC6.9 v79.31,37.25 | R61.1 87.01,51.35 89.05,49.32 89.05,38.47 X10.P$1
  other vias: 79.31,36.62 79.31,37.89
  pour Bottom (no thermals): 79.01,38.27 80.41,38.27 82.95,35.73 86.25,35.73 86.25,34.2 82.44,34.2 80.28,36.36 79.01,36.36
N$11
  Bottom 0.254: X12.P$3 90.55,45.09 X11.P$4
N$12  (via drill 0.2)
  Top 0.254: IC6.3 v78.31,27.6 | R62.1 88.66,50.46 89.55,49.57 89.55,33.01 X9.P$1
  other vias: 78.31,28.24 78.31,26.97
  pour Bottom (no thermals): 78.12,26.71 79.52,26.71 81.04,28.23 86.25,28.23 86.25,29.76 79.39,29.76 78.12,28.49
N$13  (via drill 0.2)
  Top 0.254: v79.31,50.97 IC7.9 | R59.1 83.08,51.03 X12.P$1
  other vias: 79.31,50.33 79.31,51.6
  pour Bottom (no thermals): 79.01,51.98 80.66,51.98 83.2,49.44 86.25,49.44 86.25,47.79 82.57,47.79 80.54,49.95 79.01,49.95
N$14
  Bottom 0.254: JP4.1 72.79,22.48 R10.1
N$15  (via drill 0.2)
  Top 0.254: C2.1 29.54,32.3 v29.1,32.3
  Top 0.406: J3.P$2 20.85,28.49 23.51,31.16 28.4,31.16 C2.1
  Bottom 0.254: IC2.3 v29.1,32.3
N$16  (via drill 0.2)
  Top 0.254: 10.73,5.25 CON4.1 11.86,5.39 v12.63,4.61
  Bottom 0.254: R31.1 v12.63,4.61
N$17
  Bottom 0.254: IC2.8 25.72,35.59 R4.2
N$18
  Bottom 0.254: R5.1 C4.1 R6.1
N$19
  Bottom 0.254: R7.2 SW1.4
N$20
  Bottom 0.254: IC1.8 36.09,34.84 35.32,35.6 35.32,36.8 R3.2
N$21
  Bottom 0.254: R5.2 SW2.3
N$22  (via drill 0.2)
  Top 0.254: CON5.1 6.23,6.27 v7,5.5
  Bottom 0.254: v7,5.5 7,5.54 R33.1
N$23
  Bottom 0.254: R6.2 SW2.4
N$24
  Bottom 0.254: JP3.1 70.12,13.67 R15.1
N$25  (via drill 0.2)
  Top 0.254: CON2.1 21.9,4.99 23.13,4.99 23.43,4.7 v23.43,4.23
  Bottom 0.254: R30.1 v23.43,4.23
N$26
  Bottom 0.254: R16.2 69.58,19.81 JP3.3
N$27
  Bottom 0.254: R11.2 73.68,14.39 JP4.3
N$28  (via drill 0.2)
  Top 0.254: v55.52,21.5 LED5.C
  Bottom 0.254: R17.2 v55.52,21.5
N$29  (via drill 0.2)
  Top 0.254: v59.58,21.5 LED4.C
  Bottom 0.254: R14.2 v59.58,21.5
N$30  (via drill 0.2)
  Top 0.254: v57.68,21.5 LED3.C
  Bottom 0.254: R12.2 v57.68,21.5
N$31  (via drill 0.2)
  Top 0.254: v10.05,21.25 X14.2
  Bottom 0.254: R25.1 6.24,25.06 v10.05,21.25
N$32  (via drill 0.2)
  Top 0.254: IC10.5 6.17,12.93 6.11,12.87 v6.11,12.61 7.38,12.61 R56.1 | v5.86,19.98 X15.3
  Bottom 0.254: 6.11,12.04 C15.1 | v5.86,19.98 5.86,16.17 5.22,15.54 5.22,13.12 5.73,12.61 v6.11,12.61 6.56,12.61 C15.1 | 6.43,12.74 C15.1
N$33  (via drill 0.2)
  Top 0.254: v14.37,21.25 X13.2
  Bottom 0.254: R24.1 8.15,26.33 10.94,23.54 13.35,23.54 14.37,22.52 v14.37,21.25
N$34
  Bottom 0.254: R8.2 SW1.3
N$35  (via drill 0.2)
  Top 0.254: CON3.1 17.66,5.13 17.93,4.87 v17.93,4.36
  Bottom 0.254: R28.1 v17.93,4.36
N$36
  Bottom 0.254: R19.1 88.65,26.65 Q3.1
N$37
  Bottom 0.254: R22.1 86.58,40.43 Q4.1
N$46
  Top 0.254: LED6.C R59.2
N$47
  Top 0.254: LED7.C R60.2
N$48
  Top 0.254: LED8.C R61.2
N$49
  Top 0.254: LED9.C R62.2
N$54
  Top 0.254: LED10.C 35.2,9.06 R63.2
N$59  (via drill 0.2)
  Top 0.254: X22.P$1 89.36,11.6 93.11,11.6 R72.1
  other vias: 78.31,14.04 78.31,14.68 78.31,13.41
  pour Bottom (no thermals): 78.12,14.9 78.12,13.25 84.85,13.25 86.25,14.65 86.25,16.04 84.22,16.04 83.08,14.9
N$60  (via drill 0.2)
  Top 0.254: X21.P$1 86.95,19.98 91.2,19.98 91.84,19.34 91.84,12.87 R71.1 | v79.31,23.66 IC15.9
  other vias: 79.31,23.03 79.31,24.3
  pour Bottom (no thermals): 79.01,24.55 80.41,24.55 82.82,22.14 86.25,22.14 86.25,20.62 82.31,20.62 80.16,22.77 79.01,22.77
N$61
  Top 0.254: LED12.C R71.2
N$62
  Top 0.254: LED13.C R72.2
N$63
  Bottom 0.254: R76.1 87.34,13 Q12.1
N$64
  Bottom 0.254: R74.1 87.21,19.22 Q13.1
NALERT  (via drill 0.2)
  Top 0.254: PROZ1.35 53.46,41.8 54.63,42.97 v56.02,42.97 | v59.58,24.81 LED4.A 59.58,24.43 60.47,23.54 60.47,22.27 60.85,21.89 66.69,21.89 v68.09,23.28
  Bottom 0.254: v68.09,23.28 IC4.9 | v56.02,42.97 56.02,30.78 58.56,28.23 58.56,25.82 v59.58,24.81
NALERT1  (via drill 0.2)
  Top 0.254: v69.23,47.07 X6.P$2
  Bottom 0.254: IC4.1 61.74,30.39 63.9,32.55 63.9,36.36 64.41,36.87 66.69,36.87 67.71,37.89 67.71,40.17 69.49,41.95 69.49,46.82 v69.23,47.07 | R50.2 71.48,45.8 71.14,46.14 X6.P$2
NALERT2  (via drill 0.2)
  Top 0.254: v68.72,39.45 X7.P$2
  Bottom 0.254: IC4.2 63.01,29.76 64.53,31.28 68.22,31.28 68.47,31.54 68.47,34.2 68.98,34.71 68.98,39.2 v68.72,39.45 | X7.P$2 71.14,37.8 R51.2
NALERT3
  Bottom 0.254: IC4.8 69.36,26.2 71.14,27.98 71.14,30.56 | R52.2 71.14,30.56 | 71.14,30.56 X8.P$2
NCS1  (via drill 0.2)
  Top 0.254: v47.64,51.86 50.69,48.81 59.84,48.81 60.47,48.17 60.47,42.97 62.12,41.32 CON1.5
  Bottom 0.254: IC3.15 v47.64,51.86
NCS2  (via drill 0.2)
  Top 0.254: v46.75,52.49 47.9,52.49 51.07,49.32 59.96,49.32 60.98,48.3 60.98,46.01 64.43,42.57 CON1.4
  Bottom 0.254: IC3.14 46.37,52.87 v46.75,52.49
NCS3  (via drill 0.2)
  Top 0.254: v45.48,53.13 47.9,53.13 51.2,49.82 60.09,49.82 61.49,48.43 61.49,46.27 63.94,43.82 CON1.3
  Bottom 0.254: IC3.13 45.1,53.51 v45.48,53.13
NCS4  (via drill 0.2)
  Top 0.254: v43.83,53.76 47.9,53.76 51.33,50.33 60.22,50.33 61.99,48.55 61.99,47.92 64.85,45.07 CON1.2
  Bottom 0.254: IC3.12 v43.83,53.76
NCS6  (via drill 0.2)
  Top 0.254: v41.29,54.4 47.9,54.4 51.45,50.84 74.31,50.84 75.84,52.36 80.03,52.36 80.31,52.08 IC7.8
  Bottom 0.254: IC3.10 v41.29,54.4
NCS7  (via drill 0.2)
  Top 0.254: v40.02,55.03 47.9,55.03 51.58,51.35 73.42,51.35 v73.81,51.73 | v73.81,39.54 74.19,39.16 79.77,39.16 80.28,38.65 80.28,37.26 IC6.8
  Bottom 0.254: IC3.9 v40.02,55.03 | v73.81,51.73 v73.81,39.54
NCS8  (via drill 0.2)
  Top 0.254: IC15.8 80.31,22.3 80.16,22.14 75.71,22.14 75.46,22.39 75.46,23.16 73.81,24.81 v73.81,25.82 | v41.29,48.94 41.93,48.3 59.71,48.3 59.96,48.05 59.96,42.33 61.61,40.68 70,40.68 70.25,40.93 72.92,40.93 v73.17,41.19
  Bottom 0.254: v73.81,25.82 73.81,38.52 73.17,39.16 v73.17,41.19 | IC3.7 v41.29,48.94
NFAULT  (via drill 0.2)
  Top 0.254: 44.85,40.81 v44.6,41.05 v44.59,41.05 44.85,40.8 PROZ1.53 | v57.68,24.68 LED3.A
  Bottom 0.254: v44.59,41.05 44.98,40.67 44.98,33.7 48.66,30.01 48.66,28.23 50.82,26.08 57.17,26.08 57.68,25.57 v57.68,24.68 58.31,24.04 60.98,24.04 61.49,24.55 65.55,24.55 68.09,27.09 IC4.6
NFAULT1
  Bottom 0.254: IC4.3 64.28,29.5 65.55,30.78 68.47,30.78 68.98,31.28 68.98,33.95 69.49,34.46 69.49,41.19 70,41.7 70,48.43 X6.P$1 71.99,50.42 R53.2
NFAULT2
  Bottom 0.254: IC4.4 65.55,29.5 66.31,30.27 68.85,30.27 69.49,30.9 69.49,33.82 70,34.33 70,40.81 X7.P$1 72.5,41.95 R54.2
NFAULT3
  Bottom 0.254: IC4.5 66.82,29.5 67.07,29.76 69.11,29.76 70,30.65 70,33.31 X8.P$1 71.99,35.31 R55.2
NRST
  Top 0.254: PROZ1.17 4.85,40.8 X2.4
RM_KVL1  (via drill 0.2)
  Top 0.254: PROZ1.33 53.19,42.8 54.63,44.24 v56.02,44.24 | v79.27,21.5 75.33,21.5 74.95,21.89 74.95,23.03 72.53,25.44 72.53,27.47 71.52,28.49 62.76,28.49 62.25,27.98 R73.1 61.61,26.46 v60.98,26.46
  Bottom 0.254: v60.98,26.46 60.34,26.46 59.58,27.22 59.58,28.49 57.17,30.9 57.17,43.98 56.91,44.24 v56.02,44.24 | Q13.3 84.7,18.07 80.41,18.07 79.65,18.84 79.65,21.12 v79.27,21.5
RM_KVL1_EX
  Bottom 0.254: R77.2 R74.2 90.55,19.56 X21.P$3
RM_KVL2  (via drill 0.2)
  Top 0.254: PROZ1.34 53.33,42.3 54.63,43.6 v56.53,43.6 | R75.1 63.9,27.73 64.15,27.98 71.14,27.98 71.9,27.22 71.9,25.44 74.44,22.9 74.44,16.55 v75.08,15.92
  Bottom 0.254: v56.53,43.6 56.66,43.47 56.66,30.78 59.07,28.36 59.07,26.58 59.84,25.82 R75.1 | Q12.3 78.38,12.23 77.61,13 77.61,14.14 75.84,15.92 v75.08,15.92
  other vias: 63.9,25.82
RM_KVL2_EX
  Bottom 0.254: X22.P$3 91.13,14.82 R76.2 R78.2
SCLK  (via drill 0.2)
  Top 0.254: IC7.5 80.31,39.38 80.79,38.9 82.06,38.9 83.33,37.63 83.33,34.97 | 83.33,34.97 83.33,29.12 | 83.33,29.12 83.33,13.76 81.93,12.36 80.79,12.36 80.31,12.84 IC15.5 | IC6.5 80.28,27.66 80.28,28.36 | 80.28,28.36 81.04,29.12 83.33,29.12 | 80.28,28.36 80.16,28.49 | v65.8,37.89 66.12,37.57 CON1.8 71.33,37.57 73.93,34.97 83.33,34.97
  Bottom 0.254: IC5.14 64.53,39.16 v65.8,37.89
SCLK_M  (via drill 0.2)
  Top 0.254: v64.53,35.85 64.03,36.36 59.33,36.36 58.31,37.38 53.61,37.38 53.19,37.8 PROZ1.60
  Bottom 0.254: v64.53,35.85 IC5.3
SLS_CO1  (via drill 0.2)
  Top 0.254: IC6.4 79.31,26.38 79.14,26.2 75.33,26.2 71.77,29.76 59.71,29.76 v54.63,34.84 | PROZ1.57 46.03,42.8 v45.74,43.09
  Bottom 0.254: v45.74,43.09 46.5,42.33 46.5,34.46 46.88,34.08 53.87,34.08 v54.63,34.84
SLS_RM  (via drill 0.2)
  Top 0.254: v82.06,25.7 75.2,25.7 71.77,29.12 v60.34,29.12 59.45,29.12 v54.76,33.82 | PROZ1.56 45.39,42.3 v45.1,42.59
  Bottom 0.254: Q3.3 v82.06,25.7 | R18.1 v60.34,29.13 v60.34,29.12 | v45.1,42.59 45.99,41.7 45.99,34.2 46.75,33.44 54.37,33.44 v54.76,33.82
SLS_RM_EX
  Bottom 0.254: R20.2 R19.2 90.55,26.92 X9.P$3
SPI_CS  (via drill 0.2)
  Top 0.254: PROZ1.38 v54.37,40.3
  Bottom 0.254: IC3.6 42.56,49.95 42.94,50.33 47.77,50.33 48.28,49.82 48.28,45.76 53.74,40.3 v54.37,40.3
TS1  (via drill 0.2)
  Top 0.254: v54.12,39.03 53.85,39.3 PROZ1.40
  Bottom 0.254: R30.2 R29.1 C21.2 25.12,9.19 D9.P$2 25.63,18.92 33.04,26.33 33.04,30.14 34.05,31.16 34.05,37.89 39.9,43.73 47.64,43.73 52.34,39.03 v54.12,39.03
TS2  (via drill 0.2)
  Top 0.254: v54.88,39.66 54.12,39.66 53.98,39.8 PROZ1.39
  Bottom 0.254: R28.2 R27.1 C20.2 19.66,9.19 | 19.66,9.19 D10.P$2 | 19.66,9.19 19.66,10.16 20.72,11.22 21.48,11.22 22.24,11.98 22.24,16.42 32.53,26.71 32.53,30.39 33.42,31.28 33.42,38.01 39.64,44.24 47.9,44.24 52.47,39.66 v54.88,39.66
TS3  (via drill 0.2)
  Top 0.254: PROZ1.5 v12.72,37.8
  Bottom 0.254: R31.2 R32.1 C25.2 D1.P$2 14.33,10.79 15.51,11.98 15.51,25.95 17.8,28.23 17.8,33.48 13.48,37.8 v12.72,37.8
TS4  (via drill 0.2)
  Top 0.254: PROZ1.3 13.27,37.3 v13.1,37.12
  Bottom 0.254: R33.2 R34.1 C26.2 D11.P$2 8.74,10.79 9.04,11.09 13.86,11.09 15,12.23 15,26.2 17.16,28.36 17.16,33.06 v13.1,37.12
USART_RXD  (via drill 0.2)
  Top 0.254: PROZ1.30 20.03,43.8 v20.46,44.24 | X2.10 4.97,48.3 6.75,48.3 7.38,48.94 v20.08,48.94
  Bottom 0.254: v20.08,48.94 20.46,48.55 v20.46,44.24
USART_TXD  (via drill 0.2)
  Top 0.254: PROZ1.28 20.8,43.3 v21.1,43.6 | X2.9 v20.59,49.57
  Bottom 0.254: v21.1,43.6 21.1,49.06 v20.59,49.57
VBAT  (via drill 0.2)
  Top 0.254: LED6.A LED7.A v85.93,57.58 LED8.A LED9.A | LED12.A v93.11,7.12 LED13.A | v30.75,4.36 30.75,4.04 C19.1 32.5,5.4 LED10.A
  Bottom 0.254: v37.99,7.66 38.49,7.66 D2.C | IC11.2 32.28,4.36 v30.75,4.36
  other vias: 37.99,8.68 39.01,8.68 39.01,7.66
  pour Route15 (isolate 0.152, no thermals): 95.02,0.54 95.02,58.04 79.52,58.04 79.52,53.54 81.02,52.04 84.02,52.04 86.02,50.04 86.02,15.04 87.02,14.04 89.02,14.04 90.52,12.54 90.52,9.04 88.52,7.04 60.02,7.04 59.02,8.04 59.02,13.54 58.02,14.54 42.02,14.54 40.27,13.29 31.27,13.29 30.52,12.54 30.52,0.54
VL_CO1  (via drill 0.2)
  Top 0.254: IC15.4 79.31,15.61 78.76,16.17 76.6,16.17 75.58,15.15 74.82,15.15 73.93,16.04 73.93,22.77 71.9,24.81 61.49,24.81 60.22,26.08 60.22,27.47 v54.88,32.81 | v45.36,41.44 45.99,41.44 46.13,41.3 PROZ1.54
  Bottom 0.254: v45.36,41.44 45.48,41.32 45.48,33.95 46.63,32.81 v54.88,32.81
VREF_PTC_CH  (via drill 0.2)
  Top 0.254: C22.1 v28.85,3.91 | CON5.2 6.1,7.52 v7,8.42 | CON4.2 11.82,6.64 v12.59,7.41 | CON3.2 17.66,6.38 17.93,6.65 v17.93,7.15 | CON2.2 23.38,6.38 23.51,6.52 v23.51,7.15
  Bottom 0.254: IC11.6 28.72,3.22 28.85,3.34 v28.85,3.91 | C21.1 v23.51,7.15 | C20.1 v17.93,7.15 | v12.59,7.41 C25.1 | v7,8.42 C26.1
  pour Route15 (isolate 0.152, no thermals): 0.5,10.5 0.5,2 2,0.5 29.5,0.5 29.5,10.5

## Text on the board
Bottom: TERA TU Graz / (Pöschl Rene) | BMS Master / Ibex / V3.0 | bottom
tTest: BMS Master Ibex | TERA TU Graz, April 2015 / Pöschl Rene | BMS Master / Version 3 | ALERT | GND | FAULT | NCS1 | NCS2 | NCS3 | NCS4 | MISO | MOSI | Hauptschütz | CLK | 5V | FAULT | ALERT | LEM1 | LEM2 | Charger | LEM3 | R OFF | IL | 3V3 | CAN 2 | CAN 1 | R OFF | IL | 5V | TS4 | V2 | TS3 | TS2 | TS1 | 12V | GND
bTest: CAN / Transiver | 12V | GND